# Altium schematic sheet TransBoard.SchDoc
size A4
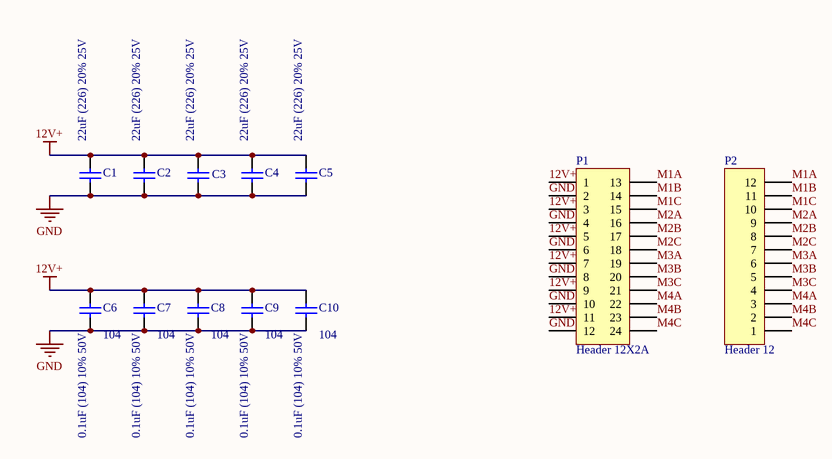
[diagram p0: TransBoard.SchDoc]

## Parts
C1  22uF (226) 20% 25V  [0805_C]
C2  22uF (226) 20% 25V  [0805_C]
C3  22uF (226) 20% 25V  [0805_C]
C4  22uF (226) 20% 25V  [0805_C]
C5  22uF (226) 20% 25V  [0805_C]
C6  0.1uF (104) 10% 50V  value 104  [0805_C]
C7  0.1uF (104) 10% 50V  value 104  [0805_C]
C8  0.1uF (104) 10% 50V  value 104  [0805_C]
C9  0.1uF (104) 10% 50V  value 104  [0805_C]
C10  0.1uF (104) 10% 50V  value 104  [0805_C]
P1  Header 12X2A  [KF128A]
P2  Header 12  [KF128A 单排]

## Nets
12V+: C1.2 C2.2 C3.2 C4.2 C5.2 C6.2 C7.2 C8.2 C9.2 C10.2 P1.1 P1.3 P1.5 P1.7 P1.9 P1.11
GND: C1.1 C2.1 C3.1 C4.1 C5.1 C6.1 C7.1 C8.1 C9.1 C10.1 P1.2 P1.4 P1.6 P1.8 P1.10 P1.12
M1A: P1.13 P2.12
M1B: P1.14 P2.11
M1C: P1.15 P2.10
M2A: P1.16 P2.9
M2B: P1.17 P2.8
M2C: P1.18 P2.7
M3A: P1.19 P2.6
M3B: P1.20 P2.5
M3C: P1.21 P2.4
M4A: P1.22 P2.3
M4B: P1.23 P2.2
M4C: P1.24 P2.1

## Library data of the parts
C1-C5 = 0805 22uF (226) 20% 25V: 贴片电容; ComponentLink1Description: 供应商链接; ComponentLink1URL: http://www.szlcsc.com/product/details_46786.html; Package: 0805; Supplier: LC; SuppliersPartNumber: C45783
C6-C10 = Cap: Capacitor; Published: 8-Jun-2000; LatestRevisionDate: 17-Jul-2002; LatestRevisionNote: Re-released for DXP Platform.; PackageReference: RAD-0.3; Publisher: Altium Limited; PackageDescription: Radial Cap, Thru-Hole; 2 Leads; 0.3 in Pin Spacing
P1 = Header 12X2A: Header, 12-Pin, Dual row; LatestRevisionDate: 17-Jul-2002; LatestRevisionNote: Re-released for DXP Platform.; Publisher: Altium Limited
P2 = Header 12: Header, 12-Pin; LatestRevisionDate: 17-Jul-2002; LatestRevisionNote: Re-released for DXP Platform.; Publisher: Altium Limited